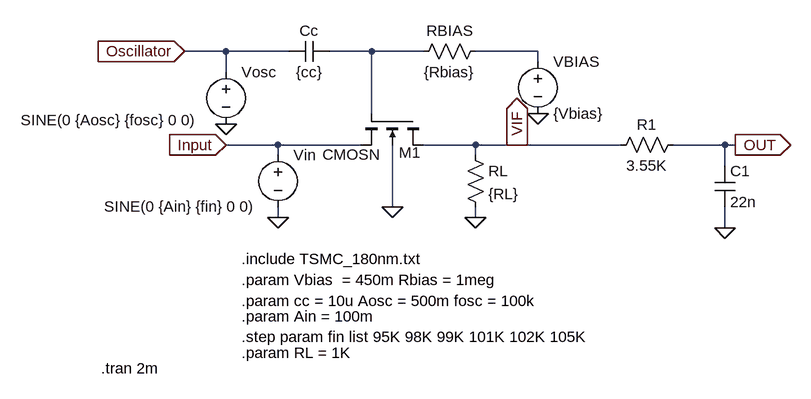
[diagram p0: schematic Mixer.asc]
Mixer.asc, the LTspice schematic file:
Version 4
SHEET 1 880 680
WIRE -544 -192 -608 -192
WIRE -448 -192 -544 -192
WIRE -320 -192 -384 -192
WIRE -240 -192 -320 -192
WIRE -64 -192 -160 -192
WIRE -64 -176 -64 -192
WIRE -544 -160 -544 -192
WIRE -320 -96 -320 -192
WIRE -464 -48 -544 -48
WIRE -336 -48 -464 -48
WIRE -160 -48 -240 -48
WIRE -96 -48 -160 -48
WIRE 64 -48 -96 -48
WIRE 224 -48 144 -48
WIRE 240 -48 224 -48
WIRE -464 -32 -464 -48
WIRE -160 -32 -160 -48
WIRE 224 -16 224 -48
WIRE -288 48 -288 -48
WIRE -464 64 -464 48
WIRE -160 64 -160 48
WIRE 224 80 224 48
FLAG -160 64 0
FLAG -464 64 0
FLAG -288 48 0
FLAG -64 -96 0
FLAG -544 -80 0
FLAG -96 -48 VIF
IOPIN -96 -48 Out
FLAG -608 -192 Oscillator
IOPIN -608 -192 In
FLAG -544 -48 Input
IOPIN -544 -48 In
FLAG 224 80 0
FLAG 240 -48 OUT
IOPIN 240 -48 Out
SYMBOL nmos4 -240 -96 R90
WINDOW 0 60 4 VRight 2
WINDOW 3 63 66 VRight 2
SYMATTR InstName M1
SYMATTR Value CMOSN
SYMATTR Value2 l=0.18u w=1.8u ad=0.81p as=0.81p pd=4.5u ps=4.5u
SYMBOL res -176 -48 R0
SYMATTR InstName RL
SYMATTR Value {RL}
SYMBOL voltage -464 -48 R0
WINDOW 3 -268 95 Left 2
WINDOW 123 0 0 Left 0
WINDOW 39 0 0 Left 0
SYMATTR Value SINE(0 {Ain} {fin} 0 0)
SYMATTR InstName Vin
SYMBOL res -144 -208 R90
WINDOW 0 0 56 VBottom 2
WINDOW 3 32 56 VTop 2
SYMATTR InstName RBIAS
SYMATTR Value {Rbias}
SYMBOL voltage -64 -192 R0
WINDOW 123 0 0 Left 0
WINDOW 39 0 0 Left 0
SYMATTR InstName VBIAS
SYMATTR Value {Vbias}
SYMBOL cap -384 -208 R90
WINDOW 0 0 32 VBottom 2
WINDOW 3 32 32 VTop 2
SYMATTR InstName Cc
SYMATTR Value {cc}
SYMBOL voltage -544 -176 R0
WINDOW 3 -316 90 Left 2
WINDOW 123 0 0 Left 0
WINDOW 39 0 0 Left 0
SYMATTR Value SINE(0 {Aosc} {fosc} 0 0)
SYMATTR InstName Vosc
SYMBOL res 160 -64 R90
WINDOW 0 0 56 VBottom 2
WINDOW 3 32 56 VTop 2
SYMATTR InstName R1
SYMATTR Value 3.55K
SYMBOL cap 208 -16 R0
SYMATTR InstName C1
SYMATTR Value 22n
TEXT -520 128 Left 2 !.include TSMC_180nm.txt
TEXT -520 160 Left 2 !.param Vbias  = 450m Rbias = 1meg
TEXT -520 192 Left 2 !.param cc = 10u Aosc = 500m fosc = 100k
TEXT -520 216 Left 2 !.param Ain = 100m
TEXT -520 248 Left 2 !.step param fin list 95K 98K 99K 101K 102K 105K
TEXT -520 272 Left 2 !.param RL = 1K
TEXT -736 296 Left 2 !.tran 2m

The netlist it stands for:
* Mixer.asc
M1 VIF N001 Input 0 CMOSN l=0.18u w=1.8u ad=0.81p as=0.81p pd=4.5u ps=4.5u
RL VIF 0 {RL}
Vin Input 0 SINE(0 {Ain} {fin} 0 0)
RBIAS N002 N001 {Rbias}
VBIAS N002 0 {Vbias}
Cc N001 Oscillator {cc}
Vosc Oscillator 0 SINE(0 {Aosc} {fosc} 0 0)
R1 OUT VIF 3.55K
C1 OUT 0 22n
.model NMOS NMOS
.model PMOS PMOS
.lib standard.mos
.include TSMC_180nm.txt
.param Vbias  = 450m Rbias = 1meg
.param cc = 10u Aosc = 500m fosc = 100k
.param Ain = 100m
.step param fin list 95K 98K 99K 101K 102K 105K
.param RL = 1K
.tran 2m
.backanno
.end